# Altium schematic sheet Xilinx_JTAG-SMT2.SchDoc
size A3
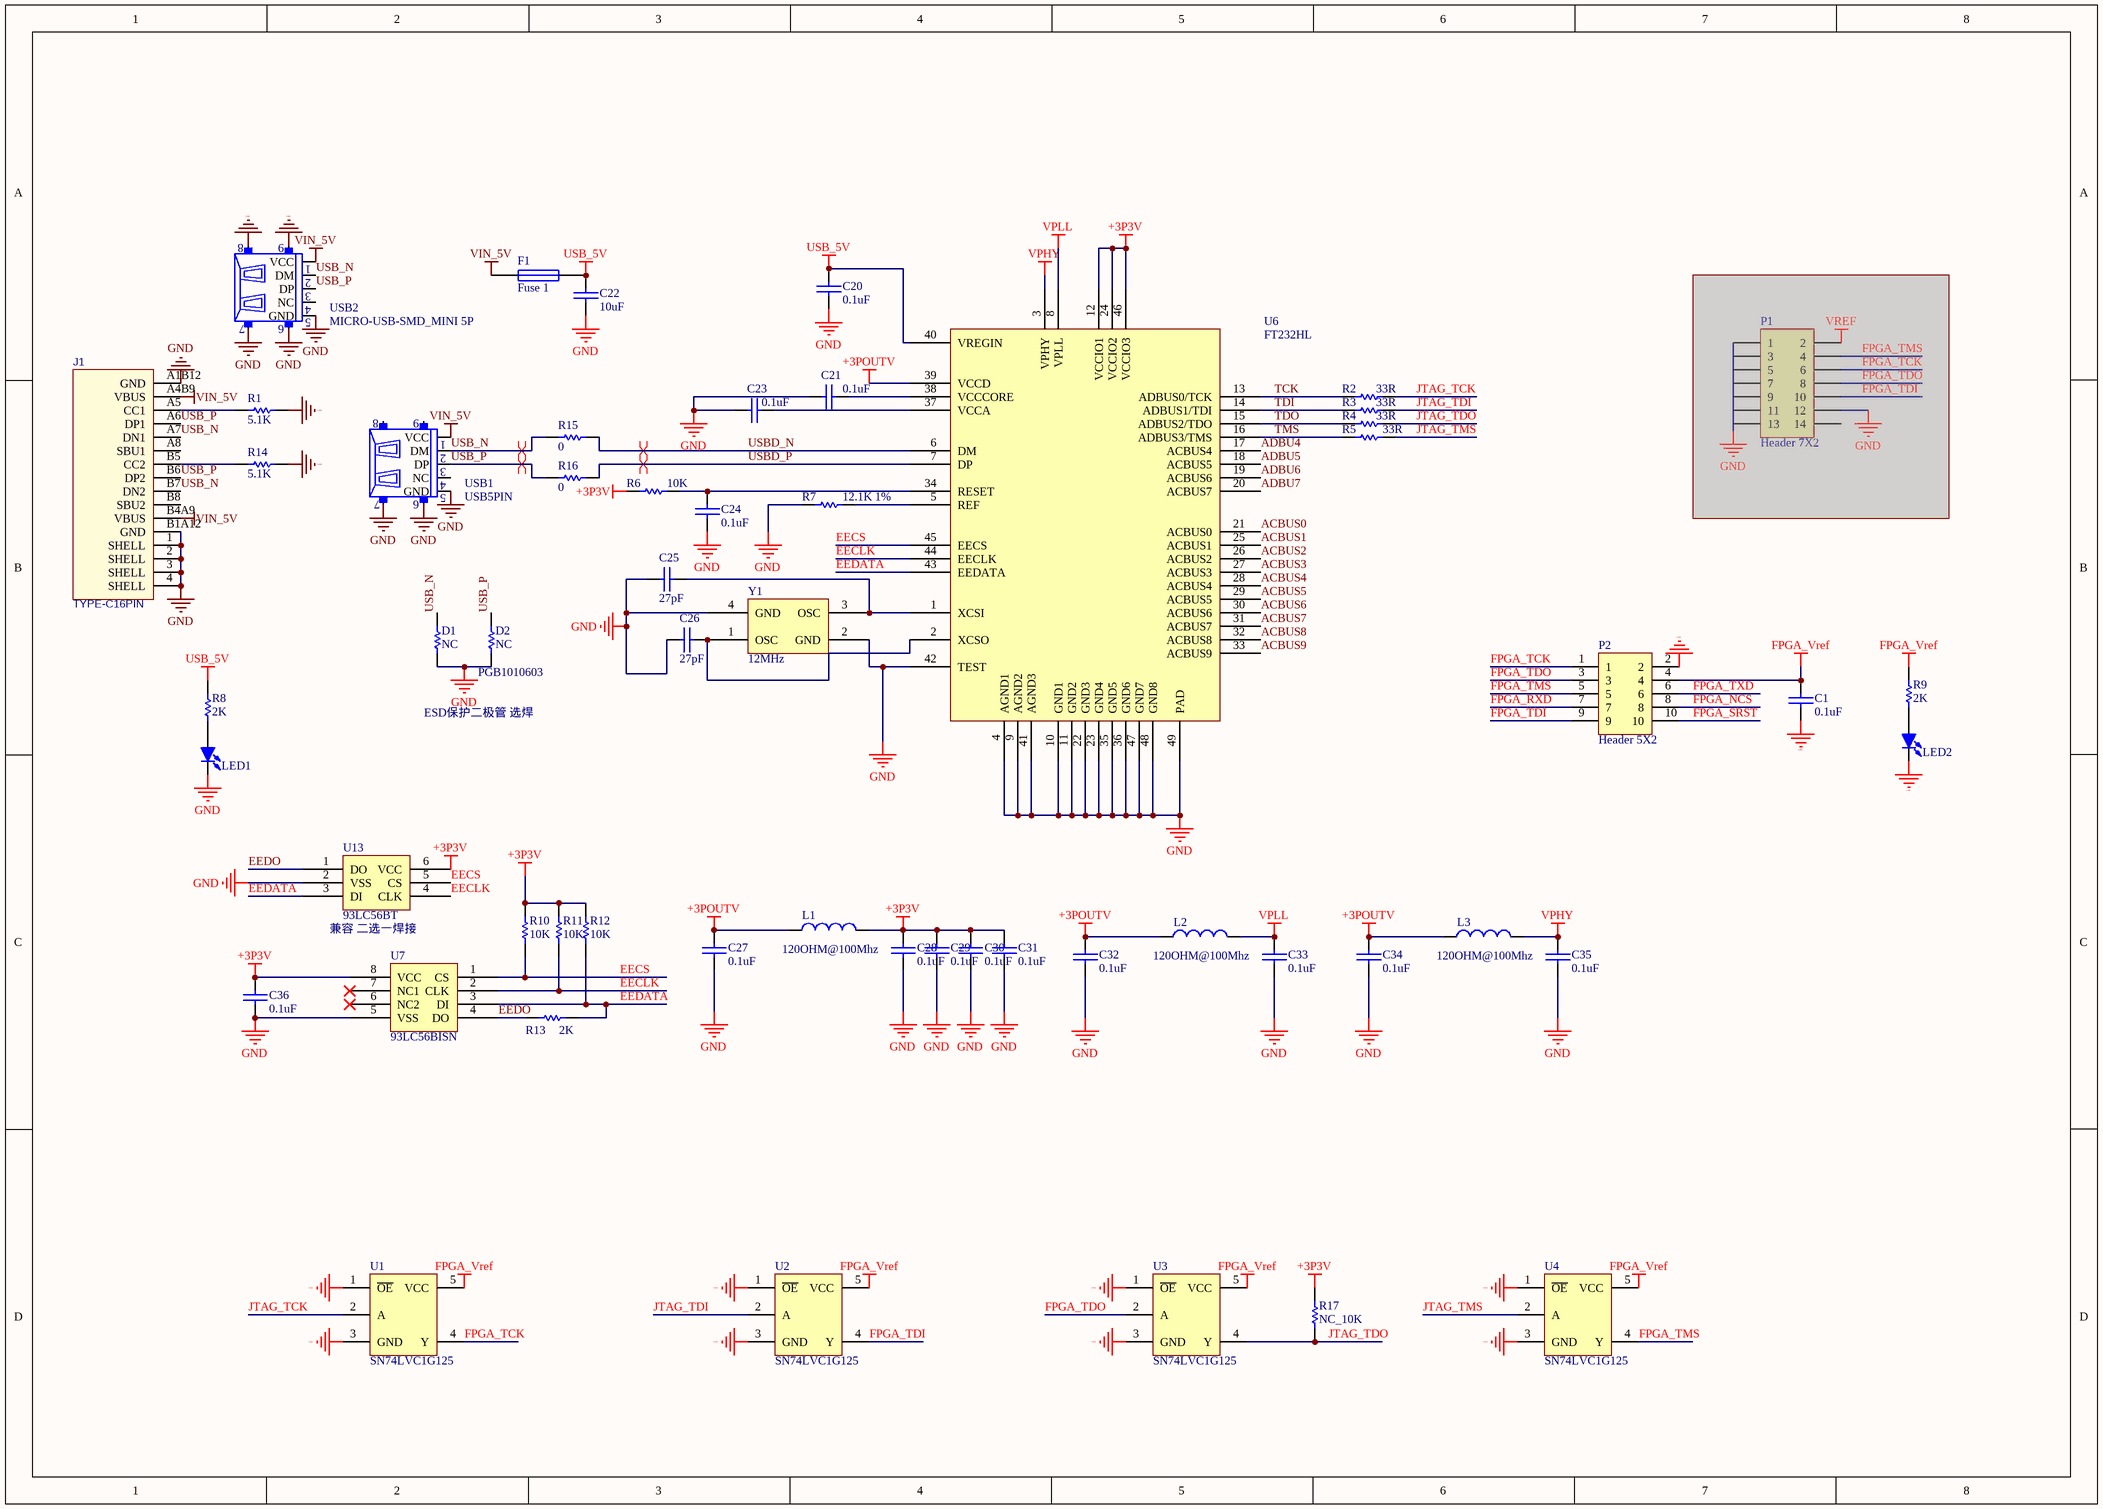
[diagram p0: Xilinx_JTAG-SMT2.SchDoc]

## Parts
C1  0.1uF  [LC-0603_C]
C20  0.1uF  [LC-0603_C]
C21  0.1uF  [LC-0603_C]
C22  10uF  [LC-1206_C]
C23  0.1uF  [LC-0603_C]
C24  0.1uF  [LC-0603_C]
C25  27pF  [LC-0603_C]
C26  27pF  [LC-0603_C]
C27  0.1uF  [LC-0603_C]
C28  0.1uF  [LC-0603_C]
C29  0.1uF  [LC-0603_C]
C30  0.1uF  [LC-0603_C]
C31  0.1uF  [LC-0603_C]
C32  0.1uF  [LC-0603_C]
C33  0.1uF  [LC-0603_C]
C34  0.1uF  [LC-0603_C]
C35  0.1uF  [LC-0603_C]
C36  0.1uF  [LC-0603_C]
D1  value NC  [LC-0603_R]  (hidden comment: Res1)
D2  value NC  [LC-0603_R]  (hidden comment: Res1)
F1  Fuse 1  [LC-1210_R]
J1  TYPE-C16PIN  [USB-C-SMD_TYPE-C16PIN]
L1  120OHM@100Mhz  [LC-0603_L]
L2  120OHM@100Mhz  [LC-0603_L]
L3  120OHM@100Mhz  [LC-0603_L]
LED1  LED-SMD  [MY-0603_LED_B]  (value not drawn)
LED2  LED-SMD  [MY-0603_LED_B]  (value not drawn)
P1  Header 7X2  [HDR2X7]  (masked out: inside a compile mask, not in the netlist)
P2  Header 5X2  [HD2x5_W]
R1  value 5.1K  [LC-0603_R]  (hidden comment: Res1)
R2  value 33R  [LC-0603_R]  (hidden comment: Res1)
R3  value 33R  [LC-0603_R]  (hidden comment: Res1)
R4  value 33R  [LC-0603_R]  (hidden comment: Res1)
R5  value 33R  [LC-0603_R]  (hidden comment: Res1)
R6  value 10K  [LC-0603_R]  (hidden comment: Res1)
R7  value 12.1K 1%  [LC-0603_R]  (hidden comment: Res1)
R8  value 2K  [LC-0603_R]  (hidden comment: Res1)
R9  value 2K  [LC-0603_R]  (hidden comment: Res1)
R10  value 10K  [LC-0603_R]  (hidden comment: Res1)
R11  value 10K  [LC-0603_R]  (hidden comment: Res1)
R12  value 10K  [LC-0603_R]  (hidden comment: Res1)
R13  value 2K  [LC-0603_L]  (hidden comment: Res1)
R14  value 5.1K  [LC-0603_R]  (hidden comment: Res1)
R15  value 0  [LC-0603_R]  (hidden comment: Res1)
R16  value 0  [LC-0603_R]  (hidden comment: Res1)
R17  value NC_10K  [LC-0603_R]  (hidden comment: Res1)
U1  SN74LVC1G125  [SOT-23-5]
U2  SN74LVC1G125  [SOT-23-5]
U3  SN74LVC1G125  [SOT-23-5]
U4  SN74LVC1G125  [SOT-23-5]
U6  FT232HL  [MY-LQFP-QFN-48_7x7x05P]
U7  93LC56BISN  [LC-SOIC-8_150mil]
U13  93LC56BT  [LC-SOT-23-6]
USB1  USB5PIN  [MICROUSB]
USB2  MICRO-USB-SMD_MINI 5P  [MICRO-USB-SMD_MINI 5P]
Y1  12MHz  [XTAL-3225]

## Nets
+3P3V: C28.1 C29.1 C30.1 C31.1 C36.1 L1.2 R6.1 R10.2 R11.2 R12.2 R17.2 U6.12(VCCIO1) U6.24(VCCIO2) U6.46(VCCIO3) U7.8(VCC) U13.6(VCC)
+3POUTV: C27.1 C32.1 C34.1 L1.1 L2.1 L3.1 U6.39(VCCD)
FPGA_Vref: C1.1 P2.4 R9.1 U1.5(VCC) U2.5(VCC) U3.5(VCC) U4.5(VCC)
GND: C1.2 C20.2 C21.2 C22.2 C23.2 C24.1 C25.1 C26.2 C27.2 C28.2 C29.2 C30.2 C31.2 C32.2 C33.2 C34.2 C35.2 C36.2 D1.2 D2.2 J1.1(SHELL) J1.2(SHELL) J1.3(SHELL) J1.4(SHELL) J1.A1B12(GND) J1.B1A12(GND) LED1.K LED2.K P2.2 R1.2 R7.1 R14.2 U1.1(~{OE}) U1.3(GND) U2.1(~{OE}) U2.3(GND) U3.1(~{OE}) U3.3(GND) U4.1(~{OE}) U4.3(GND) U6.4(AGND1) U6.9(AGND2) U6.10(GND1) U6.11(GND2) U6.22(GND3) U6.23(GND4) U6.35(GND5) U6.36(GND6) U6.41(AGND3) U6.42(TEST) U6.47(GND7) U6.48(GND8) U6.49(PAD) U7.5(VSS) U13.2(VSS) USB1.5(GND) USB1.6 USB1.7 USB2.5(GND) USB2.6 USB2.7 USB2.8 USB2.9 Y1.2(GND) Y1.4(GND)
USB_5V: C20.1 C22.1 F1.2 R8.1 U6.40(VREGIN)
VIN_5V: F1.1 J1.A4B9(VBUS) J1.B4A9(VBUS) USB1.1(VCC) USB2.1(VCC)
VPHY: C35.1 L3.2 U6.3(VPHY)
VPLL: C33.1 L2.2 U6.8(VPLL)
ACBUS0: U6.21(ACBUS0)
ACBUS1: U6.25(ACBUS1)
ACBUS2: U6.26(ACBUS2)
ACBUS3: U6.27(ACBUS3)
ACBUS4: U6.28(ACBUS4)
ACBUS5: U6.29(ACBUS5)
ACBUS6: U6.30(ACBUS6)
ACBUS7: U6.31(ACBUS7)
ACBUS8: U6.32(ACBUS8)
ACBUS9: U6.33(ACBUS9)
ADBU4: U6.17(ACBUS4)
ADBU5: U6.18(ACBUS5)
ADBU6: U6.19(ACBUS6)
ADBU7: U6.20(ACBUS7)
EECLK: R11.1 U6.44(EECLK) U7.2(CLK) U13.4(CLK)
EECS: R10.1 U6.45(EECS) U7.1(CS) U13.5(CS)
EEDATA: R12.1 R13.1 U6.43(EEDATA) U7.3(DI) U13.3(DI)
EEDO: R13.2 U7.4(DO) U13.1(DO)
FPGA_NCS: P2.8
FPGA_RXD: P2.7
FPGA_SRST: P2.10
FPGA_TCK: P2.1 U1.4(Y)
FPGA_TDI: P2.9 U2.4(Y)
FPGA_TDO: P2.3 U3.2(A)
FPGA_TMS: P2.5 U4.4(Y)
FPGA_TXD: P2.6
JTAG_TCK: R2.2 U1.2(A)
JTAG_TDI: R3.2 U2.2(A)
JTAG_TDO: R4.2 R17.1 U3.4(Y)
JTAG_TMS: R5.2 U4.2(A)
TCK: R2.1 U6.13(ADBUS0/TCK)
TDI: R3.1 U6.14(ADBUS1/TDI)
TDO: R4.1 U6.15(ADBUS2/TDO)
TMS: R5.1 U6.16(ADBUS3/TMS)
USB_N: D1.1 J1.A7(DN1) J1.B7(DN2) R15.2 USB1.2(DM) USB2.2(DM)
USB_P: D2.1 J1.A6(DP1) J1.B6(DP2) R16.2 USB1.3(DP) USB2.3(DP)
USBD_N: R15.1 U6.6(DM)
USBD_P: R16.1 U6.7(DP)
NetC21_1: C21.1 U6.38(VCCCORE)
NetC23_1: C23.1 U6.37(VCCA)
NetC24_2: C24.2 R6.2 U6.34(RESET)
NetC25_2: C25.2 U6.1(XCSI) Y1.3(OSC)
NetC26_1: C26.1 U6.2(XCSO) Y1.1(OSC)
NetJ1_A5: J1.A5(CC1) R1.1
NetJ1_B5: J1.B5(CC2) R14.1
NetLED1_A: LED1.A R8.2
NetLED2_A: LED2.A R9.2
NetR7_2: R7.2 U6.5(REF)

Not connected (* = marked no-connect by the designer): J1 A8(SBU1) B8(SBU2); U7 6(NC2)* 7(NC1)*; USB1 4(NC) 8 9; USB2 4(NC)

## Layout directives
differential pair: USB_N, USB_P, USBD_N, USBD_P

## Notes on the sheet
- ESD保护二极管 选焊
- (near D2) PGB1010603
- 兼容 二选一焊接

## Library data of the parts
C1 C20-C36 = CAP: Capacitor
D1 D2 R1-R17 = Res1: Resistor; Published: 8-Jun-2000; LatestRevisionDate: 17-Jul-2002; LatestRevisionNote: Re-released for DXP Platform.; PackageReference: AXIAL-0.3; Publisher: Altium Limited; PackageDescription: Axial Device, Thru-Hole; 2 Leads; 0.3 in Pin Spacing
F1 = Fuse 1: Fuse; Published: 8-Jun-2000; LatestRevisionDate: 17-Jul-2002; LatestRevisionNote: Re-released for DXP Platform.; PackageReference: PIN-W2/E2.8; Publisher: Altium Limited; PackageDescription: Thru-Hole; 2 Leads
J1 = TYPE-C16PIN: BOM_Manufacturer: SHOU HAN; Contributor: LCSC; BOM_Supplier: LCSC; BOM_Supplier Part: C393939; BOM_Manufacturer Part: TYPE-C16PIN; spicePre: U; spiceSymbolName: TYPE-C16PIN
L1-L3 = Inductor: Code_IEC: 1005; Published: 8-Jun-2000; LatestRevisionDate: 29-May-2009; LatestRevisionNote: IPC-7351 Footprint Added.; PackageReference: 0402-A; Publisher: Altium Limited; PackageDescription: Chip Inductor; Code_JEITA: 0402
LED1 LED2 = LED-SMD: 贴片LED; BOM名称: 贴片LED
P1 = Header 7X2: Header, 7-Pin, Dual row; LatestRevisionDate: 17-Jul-2002; LatestRevisionNote: Re-released for DXP Platform.; Publisher: Altium Limited
U13 = Component_1
USB1 USB2 = USB-5PIN
Y1 = 晶振: 5032晶振